# Altium project FMDET.PrjPcb
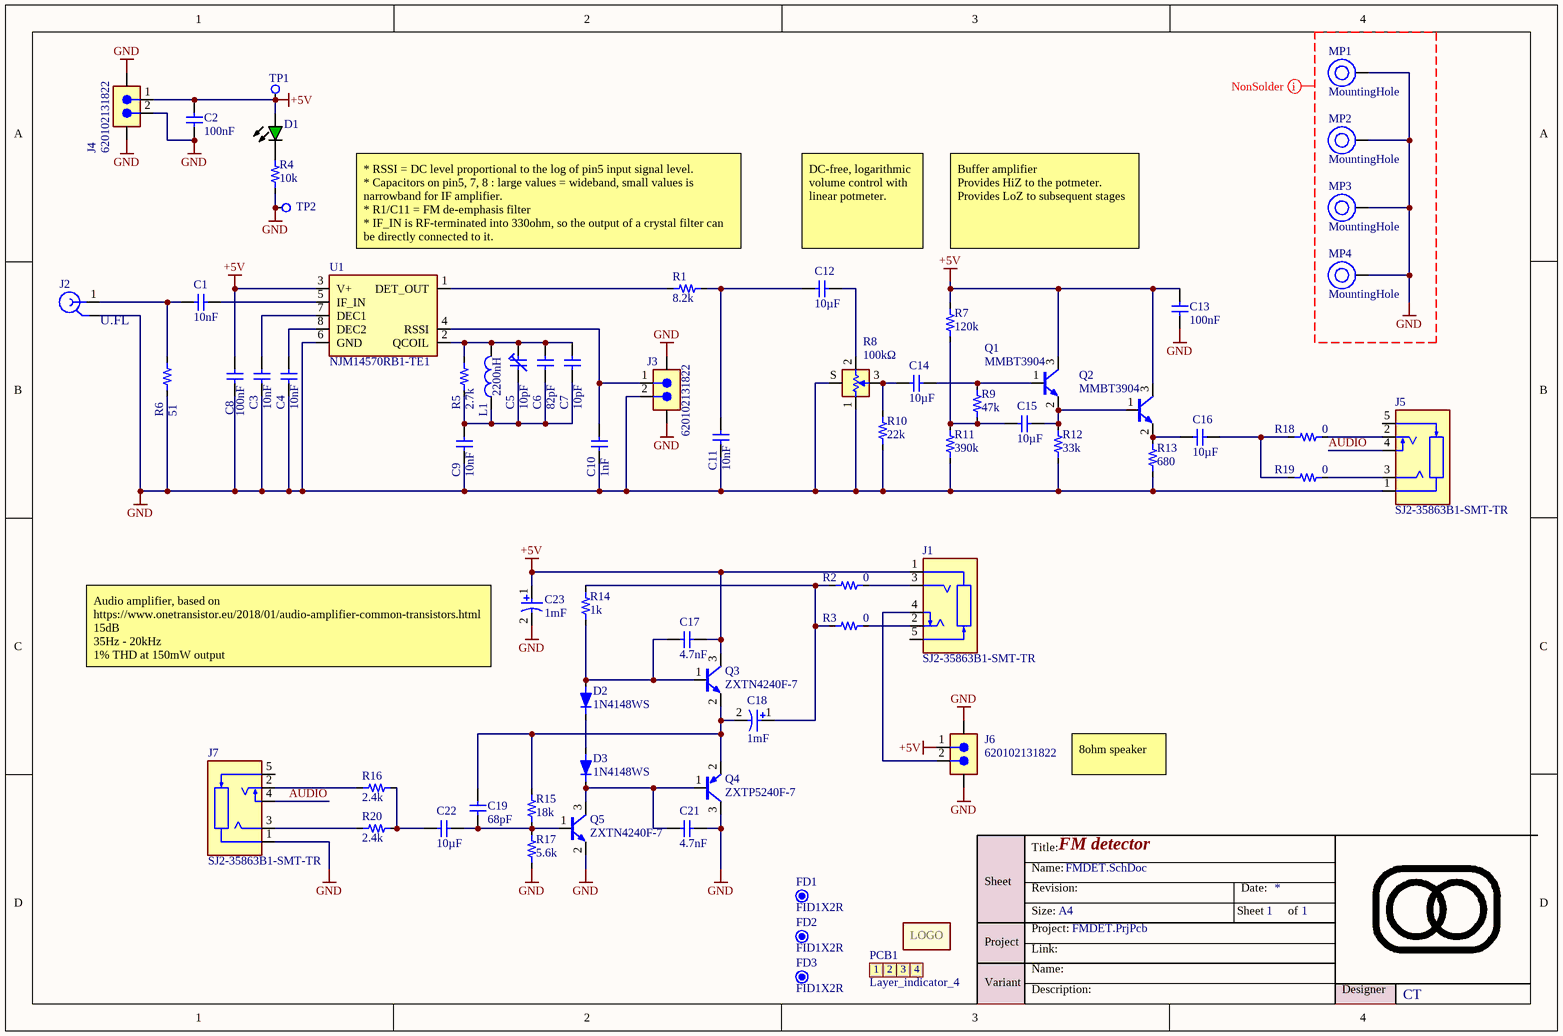
[diagram p0: FMDET.SchDoc]
assembly_revision: 0; board_name: FMDET; board_revision: 1.0
1 sheet, 70 parts. Net scope: global (net labels, ports and power ports of the same name join across sheets).
Board file: FMDET.PcbDoc

## Sheet FMDET.SchDoc: FM detector
size A4; Engineer: CT; SheetNumber: 1; SheetTotal: 1

### Parts
C1  value 10nF  [0603-C-N]  (hidden comment: Capacitor 10nF +/-10% 50V X7R 0603)
C2  value 100nF  [0603-C-N]  (hidden comment: Capacitor 100nF +/-10% 50V X7R 0603)
C3  value 10nF  [0603-C-N]  (hidden comment: Capacitor 10nF +/-10% 50V X7R 0603)
C4  value 10nF  [0603-C-N]  (hidden comment: Capacitor 10nF +/-10% 50V X7R 0603)
C5  value 10pF  [SGC3S100-Footprint-1]  (hidden comment: SGC3S100)
C6  value 82pF  [0603-C-N]  (hidden comment: Capacitor 82pF +/-5% 50V C0G 0603)
C7  value 10pF  [0603-C-N]  (hidden comment: Capacitor 10pF +/-5% 50V NP0 0603)
C8  value 100nF  [0603-C-N]  (hidden comment: Capacitor 100nF +/-10% 50V X7R 0603)
C9  value 10nF  [0603-C-N]  (hidden comment: Capacitor 10nF +/-10% 50V X7R 0603)
C10  value 1nF  [0603-C-N]  (hidden comment: Capacitor 1nF +/-10% 50V X7R 0603)
C11  value 10nF  [0603-C-N]  (hidden comment: Capacitor 10nF +/-10% 50V X7R 0603)
C12  value 10µF  [WCAP-CSGP_1210_L3.2W2.5H2.5]  (hidden comment: Capacitor 10µF +/-10% 50V X7R 1210)
C13  value 100nF  [0603-C-N]  (hidden comment: Capacitor 100nF +/-10% 50V X7R 0603)
C14  value 10µF  [WCAP-CSGP_1210_L3.2W2.5H2.5]  (hidden comment: Capacitor 10µF +/-10% 50V X7R 1210)
C15  value 10µF  [WCAP-CSGP_1210_L3.2W2.5H2.5]  (hidden comment: Capacitor 10µF +/-10% 50V X7R 1210)
C16  value 10µF  [WCAP-CSGP_1210_L3.2W2.5H2.5]  (hidden comment: Capacitor 10µF +/-10% 50V X7R 1210)
C17  value 4.7nF  [0603-C-N]  (hidden comment: Capacitor 4.7nF +/-5% 50V X7R 0603)
C18  value 1mF  [WCAP-ATLI_D10H16]  (hidden comment: 860080275016)
C19  value 68pF  [0603-C-N]  (hidden comment: Capacitor 68pF +/-5% 50V C0G 0603)
C21  value 4.7nF  [0603-C-N]  (hidden comment: Capacitor 4.7nF +/-5% 50V X7R 0603)
C22  value 10µF  [WCAP-CSGP_1210_L3.2W2.5H2.5]  (hidden comment: Capacitor 10µF +/-10% 50V X7R 1210)
C23  value 1mF  [WCAP-ATLI_D10H16]  (hidden comment: 860080275016)
D1  150060GS84000  [WL-SMCW_0603_150060xx8x000]  (value not drawn)
D2  1N4148WS  [SOD323-MFG]
D3  1N4148WS  [SOD323-MFG]
FD1  FID1X2R  [FID1X2R]  (no BOM)
FD2  FID1X2R  [FID1X2R]  (no BOM)
FD3  FID1X2R  [FID1X2R]  (no BOM)
J1  SJ2-35863B1-SMT-TR  [SJ2-35863B1-SMT-TR-Footprint-1]
J2  U.FL-R-SMT(10)  [HRS-U.FL-R-SMT_V]  (value not drawn)
J3  620102131822  [620102131822]
J4  620102131822  [620102131822]
J5  SJ2-35863B1-SMT-TR  [SJ2-35863B1-SMT-TR-Footprint-1]
J6  620102131822  [620102131822]
J7  SJ2-35863B1-SMT-TR  [SJ2-35863B1-SMT-TR-Footprint-1]
L1  Inductance: 2200nH  [WE-RFI_1008]  (hidden comment: 744762322A)
M1  Logo  [LOGO_9x6mm]  (value not drawn)  (no BOM)
MP1  MountingHole  [PTH-M3D6.5_VIA-RING]  (no BOM)
MP2  MountingHole  [PTH-M3D6.5_VIA-RING]  (no BOM)
MP3  MountingHole  [PTH-M3D6.5_VIA-RING]  (no BOM)
MP4  MountingHole  [PTH-M3D6.5_VIA-RING]  (no BOM)
PCB1  Layer_indicator_4  [LayerId_4L_4x1.5mm]  (no BOM)
Q1  MMBT3904  [SOT-23-3-N]
Q2  MMBT3904  [SOT-23-3-N]
Q3  ZXTN4240F-7  [SOT-23-3-N]
Q4  ZXTP5240F-7  [SOT-23-3-N]
Q5  ZXTN4240F-7  [SOT-23-3-N]
R1  value 8.2k  [0603-R-N]  (hidden comment: Resistor 8.2k +/-1% 0.1W 0603)
R2  value 0  [0603-R-N]  (hidden comment: Jumper 0R <50 mOhm 1A 0603)
R3  value 0  [0603-R-N]  (hidden comment: Jumper 0R <50 mOhm 1A 0603)
R4  value 10k  [0603-R-N]  (hidden comment: Resistor 10k +/-1% 50V 0603)
R5  value 2.7k  [0603-R-N]  (hidden comment: Resistor 2.7k +/-1% 0.1W 0603)
R6  value 51  [0603-R-N]  (hidden comment: Resistor 51R +/-1% 0.1W 0603)
R7  value 120k  [0603-R-N]  (hidden comment: Resistor 120K +/-1% 0603 0.1W)
R8  value 100kΩ  [PTV09A-4020F-B104-Footprint-1]  (hidden comment: PTV09A-4020F-B104)
R9  value 47k  [0603-R-N]  (hidden comment: Resistor 47k +/-1% 50V 0603)
R10  value 22k  [0603-R-N]  (hidden comment: Resistor 22k +/-1% 50V 0603)
R11  value 390k  [0603-R-N]  (hidden comment: Resistor 390k +/-1% 50V 0603)
R12  value 33k  [0603-R-N]  (hidden comment: Resistor 33k +/-1% 50V 0603)
R13  value 680  [0603-R-N]  (hidden comment: Resistor 680R +/-1% 0.1W 0603)
R14  value 1k  [0603-R-N]  (hidden comment: Resistor 1k +/-1% 50V 0603)
R15  value 18k  [0603-R-N]  (hidden comment: Resistor 18k +/-1% 50V 0603)
R16  value 2.4k  [0603-R-N]  (hidden comment: Resistor 2.4k +/-1% 50V 0603)
R17  value 5.6k  [0603-R-N]  (hidden comment: Resistor 5.6k +/-1% 0.1W 0603)
R18  value 0  [0603-R-N]  (hidden comment: Jumper 0R <50 mOhm 1A 0603)
R19  value 0  [0603-R-N]  (hidden comment: Jumper 0R <50 mOhm 1A 0603)
R20  value 2.4k  [0603-R-N]  (hidden comment: Resistor 2.4k +/-1% 50V 0603)
TP1  Testpad with multiple sizes  [TP_1.5mm_0.3mmHole]  (value not drawn)  (no BOM)
TP2  Testpad with multiple sizes  [TP_1.5mm_0.3mmHole]  (value not drawn)  (no BOM)
U1  NJM14570RB1-TE1  [MSOP8]

### Nets
+5V: C2.2 C8.2 C13.2 C17.2 C23.1 D1.2(A) J1.1 J4.1 J6.1 Q1.3(C) Q2.3(C) Q3.3(C) R7.2 TP1.1(Pad) U1.3(V+)
GND: C2.1 C3.1 C4.1 C8.1 C9.1 C10.1 C11.1 C13.1 C21.2 C23.2 J2.2(GND) J3.2 J3.MP1 J3.MP2 J4.2 J4.MP1 J4.MP2 J5.1 J6.MP1 J6.MP2 J7.1 MP1.1(H1) MP2.1(H1) MP3.1(H1) MP4.1(H1) Q4.3(C) Q5.2(E) R4.1 R6.1 R8.1(A) R8.S R10.1 R11.1 R12.1 R13.1 R17.1 TP2.1(Pad) U1.6(GND)
AUDIO: J5.4 J7.4
NetC1_1: C1.1 U1.5(IF_IN)
NetC1_2: C1.2 J2.1(SIG) R6.2
NetC3_2: C3.2 U1.7(DEC1)
NetC4_2: C4.2 U1.8(DEC2)
NetC5_1: C5.1 C6.1 C7.1 C9.2 L1.1 R5.1
NetC5_2: C5.2 C6.2 C7.2 L1.2 R5.2 U1.2(QCOIL)
NetC10_2: C10.2 J3.1 U1.4(RSSI)
NetC11_2: C11.2 C12.1 R1.1
NetC12_2: C12.2 R8.2(B)
NetC14_1: C14.1 R8.3(TAP) R10.2
NetC14_2: C14.2 Q1.1(B) R9.1
NetC15_1: C15.1 R7.1 R9.2 R11.2
NetC15_2: C15.2 Q1.2(E) Q2.1(B) R12.2
NetC16_1: C16.1 Q2.2(E) R13.2
NetC16_2: C16.2 R18.2 R19.2
NetC17_1: C17.1 D2.2(A) Q3.1(B) R14.2
NetC18_1: C18.1 R2.1 R3.1 R14.1
NetC18_2: C18.2 C19.2 Q3.2(E) Q4.2(E) R15.2
NetC19_1: C19.1 C22.1 Q5.1(B) R15.1 R17.2
NetC21_1: C21.1 D3.1(K) Q4.1(B) Q5.3(C)
NetC22_2: C22.2 R16.2 R20.2
NetD1_1: D1.1(K) R4.2
NetD2_1: D2.1(K) D3.2(A)
NetJ1_2: J1.2 R3.2
NetJ1_3: J1.3 R2.2
NetJ1_4: J1.4 J6.2
NetJ5_2: J5.2 R18.1
NetJ5_3: J5.3 R19.1
NetJ7_2: J7.2 R16.1
NetJ7_3: J7.3 R20.1
NetR1_2: R1.2 U1.1(DET_OUT)

Not connected (* = marked no-connect by the designer): J1 5; J5 5; J7 5

### Layout directives
CompClassName: NonSolder: GND

### Notes on the sheet
- * RSSI = DC level proportional to the log of pin5 input signal level.
  * Capacitors on pin5, 7, 8 : large values = wideband, small values is narrowband for IF amplifier.
  * R1/C11 = FM de-emphasis filter
  * IF_IN is RF-terminated into 330ohm, so the output of a crystal filter can be directly connected to it.
- (near C12) DC-free, logarithmic volume control with linear potmeter.
- Buffer amplifier
  Provides HiZ to the potmeter.
  Provides LoZ to subsequent stages
- (near C23) Audio amplifier, based on https://www.onetransistor.eu/2018/01/audio-amplifier-common-transistors.html
  15dB
  35Hz - 20kHz
  1% THD at 150mW output
- 8ohm speaker
- Title:
- Sheet
- Size:
- Name:
- Revision:
- A4
- Date:
- of
- Project
- Variant
- Project:
- Link:
- Description:
- Designer
- (in symbol CMP-000006-5) 1; 2; 3; 4
- (in symbol Logo) LOGO

### Library data of the parts
C1 C3 C4 C9 C11 = CMP-001-00089-18: Capacitor MLCC, General Purpose, size 0603, X7R, 10nF, +/-10%, 50V; Tolerance: 10%; Usage: General Purpose; Dielectric: X7R; RoHS Compliant: True; Min Operating Temperature: -55°C; Pins: 2; Width: 0.8mm; Case/Package: 0603; Packaging: Cut Tape; Height: 0.8mm; Max Operating Temperature: 125°C; Capacitor Type: MLCC; Length: 1.6mm; Mounting Technology: SMT; Voltage Rating: 50V; JLCPCB Part #: C57112; REACH SVHC: No SVHC
C2 C8 C13 = CMP-001-00017-25: Capacitor MLCC, General Purpose, size 0603, X7R, 100nF, +/-10%, 50V; Page Part #: CCQK104; Tolerance: 10%; Mounting Technology: SMT; Pins: 2; Max Operating Temperature: 125°C; Capacitor Type: MLCC; Dielectric: X7R; RoHS Compliant: True; Width: 0.8mm; Length: 1.6mm; Min Operating Temperature: -55°C; Usage: General Purpose; Height: 0.8mm; Case/Package: 0603; Voltage Rating: 50V; JLCPCB Part #: C14663; JLCPCB Basic part: Yes
C5 = CMP-001-00152-1: Variable Capacitor, Ceramic, 500V, 50% +Tol, 0% -Tol, 3pF Min, 10pF Max, Vertical Adjuster, Surface Mount; Lifecycle Status: Obsolete; Case/Package: SMD/SMT; JLCPCB Part #: C22468121; Length: 4.5mm; Mounting Technology: Surface Mount; RoHS: Compliant; Dielectric Material: Ceramic; Voltage Rating (DC): 500V; Height - Seated (Max): 1.4986mm; Height: 1.5mm; Min Operating Temperature: -40°C; Termination: SMD/SMT; Voltage Rating: 500V; Lead Free: Lead Free; Max Operating Temperature: 85°C; Width: 3.2mm
C6 = CMP-001-00134-4: Multilayer Ceramic Chip Capacitor, General Purpose, size 0603, C0G, 82pF, 50VDC; Tolerance: 5%; Capacitor Type: MLCC; Case/Package: 0603; Min Operating Temperature: -55°C; Usage: General Purpose; Voltage Rating: 50V; Max Operating Temperature: 125°C; Mounting Technology: SMT; Packaging: Tape and Reel; RoHS Compliant: Yes; Dielectric: C0G; JLCPCB Part #: C107056
C7 = CMP-072-000122-18: WCAP-CSGP Multilayer Ceramic Chip Capacitor, General Purpose, size 0603, NP0, 10pF, 50VDC; Page Part #: CCQJ100; Q Factor: 600; Capacitor Type: MLCC; Tolerance: 5%; Insulation Resistance: 10GO; Technical Reference: NP00603100J050DFCT10000; Usage: General Purpose; Height: 0.8mm; ComponentLink2Description: Datasheet Link; JLCPCB Part #: C106245; Min Operating Temperature: -55°C; Mounting Technology: SMT; Length: 1.6mm; Max Operating Temperature: 125°C; Case/Package: 0603; ComponentLink1URL: https://www.we-online.com/redexpert/article/885012006051?ad; Source: WCAP-CSGP.SchLib; ComponentLink1Description: Website Link; Pins: 2; Width: 0.8mm; Voltage Rating: 50V; Match Code: WCAP-CSGP; Dielectric: NP0; ComponentLink2URL: https://www.we-online.com/redexpert/spec/885012006051?ad; Design Item ID: 885012006051; Packaging: Tape and Reel
C10 = CMP-072-000605-15: WCAP-CSGP Multilayer Ceramic Chip Capacitor, General Purpose, size 0603, X7R, 1nF, 50VDC; Capacitor Type: MLCC; Tolerance: 10%; Technical Reference: X7R0603102K050DFCT10000; Dissipation Factor: 2.5%; Insulation Resistance: 10GO; Design Item ID: 885012206083; Max Operating Temperature: 125°C; ComponentLink1Description: Website Link; ComponentLink1URL: https://www.we-online.com/redexpert/article/885012206083?ad; Height: 0.8mm; ComponentLink2Description: Datasheet Link; Min Operating Temperature: -55°C; Usage: General Purpose; Packaging: Tape and Reel; ComponentLink2URL: https://www.we-online.com/redexpert/spec/885012206083?ad; Case/Package: 0603; Voltage Rating: 50V; Match Code: WCAP-CSGP; Pins: 2; JLCPCB Part #: C1588; Source: WCAP-CSGP.SchLib; Dielectric: X7R; Mounting Technology: SMT; Length: 1.6mm; Width: 0.8mm
C12 C14-C16 C22 = CMP-072-000922-16: WCAP-CSGP Multilayer Ceramic Chip Capacitor, General Purpose, size 1210, X7R, 10µF, 50VDC; Dissipation Factor: 10%; Capacitor Type: MLCC; Insulation Resistance: 0.01GO; Technical Reference: X7R1210106K050DFCT10000; Max Operating Temperature: 125°C; Mounting Technology: SMT; Pins: 2; Height: 2.5mm; ComponentLink2Description: Datasheet Link; ComponentLink1Description: Website Link; Packaging: Tape and Reel; Source: WCAP-CSGP.SchLib; Length: 3.2mm; Width: 2.5mm; Design Item ID: 885012209073; ComponentLink2URL: https://www.we-online.com/redexpert/spec/885012209073?ad; Usage: General Purpose; ComponentLink1URL: https://www.we-online.com/redexpert/article/885012209073?ad; Dielectric: X7R; Case/Package: 1210; Match Code: WCAP-CSGP; Voltage Rating: 50V; Min Operating Temperature: -55°C; JLCPCB Part #: C77102; Tolerance: 10%
C17 C21 = CMP-001-00108-13: Capacitor MLCC, General Purpose, size 0603, X7R, 4.7nF, +/-5%, 50V; Tolerance: 5%; Dielectric: X7R; Length: 1.6mm; JLCPCB Part #: C53987; Width: 0.8mm; Voltage Rating: 50V; JLCPCB Basic Part: Yes; Usage: General Purpose; Min Operating Temperature: -55°C; Case/Package: 0603; Pins: 2; RoHS Compliant: Yes; Max Operating Temperature: 125°C; Capacitor Type: MLCC; Mounting Technology: SMT; Height: 0.8mm
C18 C23 = CMP-001-00153-2: Alum. Electrolytic Cap 1000F 10V 10MM Radial Wcap-atli; Lifetime 5000H +105°C; Tolerance: 20%; Life (Hours): 5000hours; Pitch: 5mm; Polarity: Polar; Leakage Current: 100µA; Impedance: 42mΩ; Ripple Current: 1.4A; Max Operating Temperature: 105°C; Voltage Rating: 10V; Height - Seated (Max): 17.4752mm; Length: 16mm; RoHS: Compliant; Diameter: 10mm; Min Operating Temperature: -55°C; Mounting Technology: Through Hole; Lead Pitch: 5.0038mm; Case/Package: Radial; Packaging: Cut Tape (CT); JLCPCB Part #: C43339
C19 = CMP-001-00092-16: Capacitor MLCC, General Purpose, size 0603, C0G, 68pF, +/-5%, 50V; Tolerance: 5%; Temperature Coefficient: 30ppm/°C; JLCPCB Part #: C62782; Usage: General Purpose; Mounting Technology: SMT; Case/Package: 0603; Min Operating Temperature: -55°C; REACH SVHC: Unknown; Max Operating Temperature: 125°C; Dielectric: C0G; Packaging: Cut Tape; RoHS Compliant: True; Voltage Rating: 50V; Pins: 2; Width: 0.8mm; Length: 1.6mm; Capacitor Type: MLCC; Height: 0.8mm
D1 = CMP-002-001076-16: WL-SMCW Mono-color Chip LED Waterclear, size 0603, Green, 3.3V, 40°; Manufacturer: Wurth Elektronik; Page Part #: MOVPA-0270A; Chip Technology: InGaN; Case/Size Code: 0603; Luminous Intensity: 3000mcd; Peak Wavelength: 520nm; Dominant Wavelength: 525nm; Mount: Surface Mount; Design Item ID: 150060GS84000; Category: Signal LEDs; Component Type: Standard; Emitting Color: Green; Viewing Angle: 40°; Height: 0.95mm; Width: 0.8mm; Length: 1.6mm; JLCPCB Part #: C7429914; Packaging: Tape and Reel; Match Code: WL-SMCW; ComponentLink2Description: Datasheet Link; Forward Voltage: 3.3V; ComponentLink1Description: Website Link; ComponentLink2URL: https://www.we-online.com/redexpert/spec/150060GS84000?ad; Source: WL-SMCW.SchLib; Operating Temperature Max: 85°C; Manufacturer Part Number: 150060GS84000; Pin Count: 2; Operating Temperature Min: -40°C; ComponentLink1URL: https://www.we-online.com/redexpert/article/150060GS84000?ad
D2 D3 = CMP-004-00001-5: Small Signal Diode, 75 V, 0.15 A, -55 to 150 degC, 2-Pin SOD-323, RoHS, Tape and Reel; Manufacturer: Fairchild; Forward Voltage: 1V; Forward Current: 150mA; Max Reverse Voltage (DC): 70V; Recovery Time: 4ns; Peak Reverse Current: 5uA; Capacitance: -323f; JLCPCB Basic Part: Yes; Package Reference: SOD-323; Packaging: TapeandReel; Case/Package: SOD-323; Package Description: 2-Pin Small Outline Diode Flat Lead, Body 1.7 x 1.25 mm; JLCPCB Part #: C2128; Max Operating Temperature: 150°C; Pins: 2; RoHS Compliant: True; Manufacturer URL: https://www.fairchildsemi.com/; Package Quantity: 3000; Mounting Technology: SM; Datasheet Version: Rev. 1.2, 03/2015; Min Operating Temperature: -55°C; Datasheet URL: https://www.fairchildsemi.com/datasheets/1N/1N4148WS.pdf
FD1-FD3 = CMP-00028-00005-14: Fiducial - Round 1x2mm; Pins: 0
J1 J5 J7 = CMP-002-00128-5: 3.5 mm, Stereo, Right Angle, Surface Mount (SMT), Audio Jack Connector; Value: 3.5mm audio jack; Shielding: Unshielded; Number of Ports: 1; Number of Conductors: 3; Orientation: Horizontal; Connector Type: Jack; JLCPCB Part #: C381135; Color: Black
J2 = CMP-002-00035-13: Ultra Small Surface Mount Coaxial Connector, 50 Ohm, -40 to 90 degC, 3-Pin SMD, RoHS, Tape and Reel; pin to pad: 1>3 2>1+2; Manufacturer: Hirose Electric; Connector Type: RF&Coax; Impedance: 50Ohm; Value: U.FL; Case/Package: U.FL-R-SMT; Package Quantity: 2500; Packaging: TapeandReel; RoHS Compliant: True; Contact Material: Brass; Contact Plating: Gold; Min Operating Temperature: -40°C; JLCPCB Part #: C88373; Package Reference: U.FL-R-SMT; Datasheet Version: Aug-16; Manufacturer URL: https://www.hirose.com; Max Operating Temperature: 90°C; Fastening Type: Snap; Package Description: 3-Pin Surface Mount Device, Body 2.6 x 2.6 mm; Resistance: 50Ohm; Mounting Technology: SM; Datasheet URL: https://www.hirose.com/product/en/download_file/key_name/U.FL/category/Catalog/doc_file_id/31697/?file_category_id=4&item_id=15&is_series=1
J3 J4 J6 = CMP-047-000040-16: WR-WTB SMT Male Horizontal Shrouded Header, pitch 2mm, 2p; Page Part #: K620102131822; Pin Number: 2; Rated Current: 2A; Contact Resistance: 20mOhm; Value: JST-PH; Withstanding Voltage: 800VAC; Working Voltage: 100VAC; Source: WR-WTB_2.00mm.SchLib; Operating Temperature: -25 to +85degC; JLCPCB Part #: C295747; Pin Count: 2; Pitch: 2mm; Part Number: 620102131822; Component Type: Standard; Packaging: Tape and Reel; Type: Horizontal; Publisher: Wurth Elektronik; Gender: Male; ComponentLink2Description: Datasheet; ComponentLink1Description: Manufacturer; Mounting Technology: SMT; ComponentLink1URL: http://www.we-online.de; ComponentLink2URL: https://www.we-online.com/catalog/datasheet/620102131822.pdf; Published Date: January 2020; Design Item ID: 620102131822
L1 = CMP-186-000045-3: WE-RFI Ferrite SMT Inductor, size 1008, 2200nH, 200mA, 160MHz; Manufacturer: Wurth Elektronik; DC Resistance Max: 2350mOhm; Impedance Max: 105000Ohm; Case/Size Code: 1008; Impedance @100MHz: 1550Ohm; Impedance Max Test Condition: 270MHz; Inductance Tolerance: +/-5%; Q Factor Min: 20; Width: 2mm; Mount: Surface Mount; Category: RF Inductors; ComponentLink1URL: https://www.we-online.com/redexpert/article/744762322A?ad; Self Resonant Frequency: 160MHz; Length: 2.5mm; ComponentLink2URL: https://www.we-online.com/redexpert/spec/744762322A?ad; Component Type: Standard; Design Item ID: 744762322A; Height: 1.6mm; Operating Temperature Max: 85°C; Manufacturer Part Number: 744762322A; Source: WE-RFI.SchLib; ComponentLink1Description: Website Link; Packaging: Tape and Reel; ComponentLink2Description: Datasheet Link; Pin Count: 2; Rated Current: 200mA; Match Code: WE-RFI; Operating Temperature Min: -40°C; JLCPCB Part #: C703712
MP1-MP4 = CMP-00028-00004-15: Mounting hole.  Add this so that mounting holes placed in your design don't automagically disappear when you import changes from the schematic.; Pins: 1
PCB1 = CMP-000006-5: Layer indicator for 4 layers
Q1 Q2 = CMP-014-00026-5: NPN General Purpose Amplifier, 40 V, 0.2 A, -55 to 150 degC, 3-Pin SOT23, RoHS, Tape and Reel; Manufacturer: Fairchild Semiconductor; Elements: 1; hFE Min: 100; Package Version: Rev. 12, 03/2016; Frequency: 300MHz; Vce Max: 300mV; Power: 625mW; JLCPCB Part #: C20526; Mounting Technology: SM; Package Reference: SOT23-3; Pins: 3; Max Operating Temperature: 150°C; RoHS Compliant: True; Case/Package: TO-236-3; Manufacturer URL: https://www.fairchildsemi.com/; Datasheet URL: https://www.fairchildsemi.com/datasheets/MM/MMBT3904.pdf; Datasheet Version: Rev. 1.1.0, 10/2014; Min Operating Temperature: -55°C; JLCPCB Basic Part: Yes; Package Quantity: 3000; Packaging: TapeandReel; Package URL: http://www.fairchildsemi.com/dwg/MA/MA03D.pdf; Package Description: 3-Pin Small Outline Transistor, Body 2.92 x 1.325 mm, Pitch 0.95 mm
Q3 Q5 = CMP-013-00066-1: Trans GP BJT NPN 40V 2A 730mW Automotive 3-Pin SOT-23 T/R; hFE Min: 150; Transition Frequency: 100MHz; Collector Emitter Saturation Voltage: 320mV; Number of Elements: 1; JLCPCB Basic Part: No; JLCPCB Part #: C513079; Max Power Dissipation: 730mW; Lifecycle Status: Production; Number of Terminals: 3; Collector Emitter Voltage (VCEO): 40V; RoHS: Compliant; Min Operating Temperature: -55°C; Max Operating Temperature: 150°C; Max Collector Current: 2A; REACH SVHC: Yes; China RoHS: Compliant
Q4 = CMP-013-00067-2: Bipolar Transistors - BJT 40V PNP SS Mid-Perf Transistor; Max Collector Current: 2A; Number of Elements: 1; hFE Min: 100; Transition Frequency: 100MHz; JLCPCB Basic Part: No; Min Operating Temperature: -55°C; JLCPCB Part #: C3199979; RoHS: Compliant; REACH SVHC: Yes; Collector Emitter Voltage (VCEO): 40V; Lifecycle Status: Production; Number of Terminals: 3; China RoHS: Compliant
R1 = CMP-009-00285-10: Res Thick Film 0603 8.2K Ohm 1% 0.1W(1/10W) ±100ppm/C Pad SMD T/R; Temperature Coefficient: 100ppm/°C; Elements: 1; Usage: General Purpose; Voltage Rating: 50V; Power Rating: 100mW; Max Operating Temperature: 155°C; Features: Moisture Resistant; Tolerance: 1%; Pins: 2; Case/Package: 0603; RoHS Compliant: Yes; Lead Free: Lead Free; Min Operating Temperature: -55°C; Resistor Type: Thick Film; Mounting Technology: SMT; Reach SVHC Compliant: Yes; JLCPCB Part #: C25981
R2 R3 R18 R19 = CMP-009-00006-27: Chip Jumper, Thick Film, Jumper, 0603, 100mW, 1A, 0 Ohm, <50 mOhm; FLIR Part #: YRES0E-1; Page Part #: ROQJ0000; Elements: 1; Tolerance: 50 mOhm; Voltage Rating: 75V; Power Rating: 100mW; Min Operating Temperature: -55°C; Usage: Jumper; JLCPCB Basic Part: Yes; Mounting Technology: SMT; Max Operating Temperature: 155°C; Case/Package: 0603; Pins: 2; Current Rating: 1A; JLCPCB Part #: C21189; RoHS Compliant: True; Resistor Type: Thick Film
R4 = CMP-009-00017-29: Chip Resistor, Thick Film, General Purpose, 0603, 100mW, 50V, 10 kOhm, +/-1%; FLIR Part #: YRES10K-1; Page Part #: ROQF1002; Elements: 1; Tolerance: 1%; Pins: 2; Resistor Type: Thick Film; Voltage Rating: 50V; Power Rating: 100mW; Mounting Technology: SMT; Min Operating Temperature: -55°C; Case/Package: 0603; RoHS Compliant: Yes; Usage: General Purpose; JLCPCB Part #: C25804; Max Operating Temperature: 155°C; JLCPCB Basic part: Yes
R5 = CMP-009-00257-14: Res Thick Film 0603 2.7K Ohm 1% 0.1W(1/10W) ±100ppm/C Pad SMD Automotive T/R; Voltage Rating: 75V; Power Rating: 100mW; Usage: Precision; Elements: 1; Temperature Coefficient: 100ppm/°C; Resistor Type: Thick Film; RoHS Compliant: Yes; Packaging: Tape and Reel; Pins: 2; Tolerance: 1%; Features: Automotive AEC-Q200; Min Operating Temperature: -55°C; Mounting Technology: SMT; JLCPCB Part #: C13167; Case/Package: 0603; Max Operating Temperature: 155°C; Lead Free: Lead Free
R6 = CMP-009-00338-5: Res Thick Film 0603 51 Ohm 1% 1/10W ±100ppm/°C Molded SMD SMD Paper T/R; Power Rating: 100mW; Usage: General Purpose; Elements: 1; Temperature Coefficient: 100ppm/°C; Features: Automotive AEC-Q200; Max Operating Temperature: 155°C; Mounting Technology: SMT; RoHS Compliant: Yes; Case/Package: 0603; JLCPCB Part #: C23197; Pins: 2; Tolerance: 1%; Lead Free: Lead Free; Radiation Hardening: No; Resistor Type: Thick Film; Min Operating Temperature: -55°C
R7 = CMP-009-00281-11: Res Thick Film 0603 120K Ohm 1% 0.1W(1/10W) ±100ppm/°C Pad SMD T/R; FLIR Part #: YRES120K-1; Usage: General Purpose; Power Rating: 100mW; Elements: 1; Tolerance: 1%; Case/Package: 0603; Min Operating Temperature: -55°C; JLCPCB Part #: C25808; Mounting Technology: SMT; Pins: 2; Max Operating Temperature: 155°C; Resistor Type: Thick Film
R8 = CMP-009-00422-1: Potentiometer, Carbon, 0.05W, 100000ohm, 20V, 20% +/-Tol, 1 Turn(s); pin to pad: 2>3 3>2 S>S1+S2; Number of Gangs: 1; Max Power Dissipation: 50mW; Actuator Diameter: 5.9944mm; Actuator Length: 19.9898mm; JLCPCB Part #: C5154557; Depth: 12.5mm; Packaging: Bulk; Contact Plating: Tin; REACH SVHC: Yes; Case/Package: Radial; Mounting Technology: Brackets, Snap-In, Through Hole; Composition: Carbon; Taper: Linear; Number of Terminals: 3; Termination: Pin; Length: 11.4mm; Type: Potentiometer; Tolerance: 20%; Min Operating Temperature: -10°C; Lifecycle Status: Production; Height: 6.8mm; Radiation Hardening: No; Schedule B: 8533400080; Working Voltage: 20V; Military Standard: Not; Power Dissipation: 50mW; Number of Turns: 1; Width: 6.8mm; Power Rating: 50mW; RoHS: Compliant; Max Operating Temperature: 50°C
R9 = CMP-009-00195-22: Chip Resistor, Thick Film, General Purpose, 0603, 100mW, 50V, 47 kOhm, +/-1%; FLIR Part #: YRES47K-1; Page Part #: ROQF4702; Temperature Coefficient: 100ppm/°C; Elements: 1; Tolerance: 1%; REACH SVHC: No SVHC; Pins: 2; Power Rating: 100mW; Case/Package: 0603; Max Operating Temperature: 155°C; Resistor Type: Thick Film; JLCPCB Part #: C25819; Usage: General Purpose; Min Operating Temperature: -55°C; Voltage Rating: 50V; Mounting Technology: SMT
R10 = CMP-009-00245-17: Chip Resistor, Thick Film, General Purpose, 0603, 100mW, 50V, 22 kOhm, +/-1%; Elements: 1; Tolerance: 1%; JLCPCB Part #: C31850; Resistor Type: Thick Film; Mounting Technology: SMT; Case/Package: 0603; Min Operating Temperature: -55°C; Power Rating: 100mW; Usage: General Purpose; Voltage Rating: 50V; Max Operating Temperature: 155°C; Pins: 2; RoHS Compliant: Yes
R11 = CMP-009-00370-6: SMD Chip Resistor, 390 kOhm, ± 1%, 100 mW, 0603 [1608 Metric], Thick Film, General Purpose; FLIR Part #: YRES390K-1; Power Rating: 100mW; Temperature Coefficient: 100ppm/°C; Working Voltage: 75V; Series: RC; Technology: THICK FILM; Termination: SMD/SMT; Voltage Rating (DC): 50V; Military Standard: Not; RoHS Compliant: Yes; JLCPCB Part #: C23150; Number of Terminations: 2; Pins: 2; Case/Package: 0603; Resistance Tolerance: 1%; Length: 1.6mm; Case Code (Imperial): 0603; Lead Free: Lead Free; Packaging: Tape and Reel; Construction: Rectangular; Max Power Dissipation: 100mW; Width: 0.8mm; Height: 0.45mm; Min Operating Temperature: -55°C; Features: Moisture Resistant; Reach SVHC Compliant: Unknown; Max Operating Temperature: 155°C; Usage: General Purpose; Tolerance: 1%; Case Code (Metric): 1608; Resistor Type: Thick Film; Voltage Rating (AC): 50V; Voltage Rating: 50V; Depth: 0.8mm
R12 = CMP-009-00214-17: Chip Resistor, Thick Film, General Purpose, 0603, 100mW, 50V, 33 kOhm, +/-1%; Elements: 1; Tolerance: 1%; Max Operating Temperature: 155°C; Power Rating: 100mW; Pins: 2; Mounting Technology: SMT; Usage: General Purpose; RoHS Compliant: Yes; Resistor Type: Thick Film; Voltage Rating: 50V; Case/Package: 0603; Min Operating Temperature: -55°C; JLCPCB Part #: C4216
R13 = CMP-009-00393-2: SMD Chip Resistor, 680 Ohm, ï¿½ 1%, 100 mW, 0603 [1608 Metric], Thick Film, Precision; Page Part #: ROQF6800; Voltage Rating: 75V; Power Rating: 100mW; Temperature Coefficient: 100ppm/°C; Packaging: Tape and Reel; Pins: 2; Reach SVHC Compliant: No; Resistance Tolerance: 1%; Resistor Type: Thick Film; Construction: Rectangular; Features: Automotive AEC-Q200; Case/Package: 0603; Series: ERJ; Contact Plating: Tin; Lead Free: Lead Free; Width: 0.8mm; Number of Terminations: 2; Length: 1.6mm; Min Operating Temperature: -55°C; Case Code (Metric): 1608; Case Code (Imperial): 0603; Radiation Hardening: No; Military Standard: Not; Depth: 0.8mm; RoHS Compliant: Yes; Termination: SMD/SMT; Mounting Technology: Surface Mount; Height: 0.022inch; Package Quantity: 1; Max Power Dissipation: 100mW; Voltage Rating (DC): 75V; JLCPCB Part #: C23228; Max Operating Temperature: 155°C; Tolerance: 1%
R14 = CMP-009-00014-30: Chip Resistor, Thick Film, General Purpose, 0603, 100mW, 50V, 1 kOhm, +/-1%; Page Part #: ROQF1001; FLIR Part #: YRES1K-1; Tolerance: 1%; Elements: 1; Mounting Technology: SMT; Max Operating Temperature: 155°C; Voltage Rating: 50V; Power Rating: 100mW; Min Operating Temperature: -55°C; JLCPCB Basic Part: Yes; Case/Package: 0603; JLCPCB Part #: C21190; RoHS Compliant: Yes; Usage: General Purpose; Resistor Type: Thick Film; Pins: 2
R15 = CMP-009-00206-23: Chip Resistor, Thick Film, General Purpose, 0603, 100mW, 50V, 18 kOhm, +/-1%; Page Part #: ROQF1802; Tolerance: 1%; Elements: 1; Mounting Technology: SMT; Power Rating: 100mW; Min Operating Temperature: -55°C; Voltage Rating: 50V; Max Operating Temperature: 155°C; Case/Package: 0603; Resistor Type: Thick Film; Usage: General Purpose; Pins: 2; RoHS Compliant: Yes; JLCPCB Part #: C25810
R16 R20 = CMP-009-00323-9: Chip Resistor, Thick Film, General Purpose, 0603, 100mW, 50V, 2.4 kOhm, +/-1%; Temperature Coefficient: 100ppm/°C; Elements: 1; Tolerance: 1%; Max Operating Temperature: 155°C; Voltage Rating: 50V; JLCPCB Part #: C22940; Case/Package: 0603; Usage: General Purpose; Min Operating Temperature: -55°C; Resistor Type: Thick Film; Mounting Technology: SMT; Pins: 2; Power Rating: 100mW
R17 = CMP-009-00287-10: Res Thick Film 0603 5.6K Ohm 1% 0.1W(1/10W) ±100ppm/C Pad SMD T/R; Voltage Rating: 75V; Power Rating: 100mW; Temperature Coefficient: 100ppm/°C; Usage: General Purpose; Elements: 1; Max Operating Temperature: 155°C; Lead Free: Lead Free; Features: Moisture Resistant; Tolerance: 1%; JLCPCB Part #: C23189; Mounting Technology: SMT; Min Operating Temperature: -55°C; Pins: 2; Case/Package: 0603; Resistor Type: Thick Film; RoHS Compliant: Yes
TP1 TP2 = CMP-027-000000-20: Testpad land; Design Item ID: Testpad; Component Type: Standard; Pin Count: 1
U1 = CMP-015-00050-1: Modulator / Demodulator Wide-B FM IF Demod 1.8 to 9V 2.9mA 15; RoHS: Non-Compliant; JLCPCB Part #: C5200653

## Assembly variants
A: all parts fitted